# EAGLE schematic centuryBoosterPac (EAGLE 7.2.0)
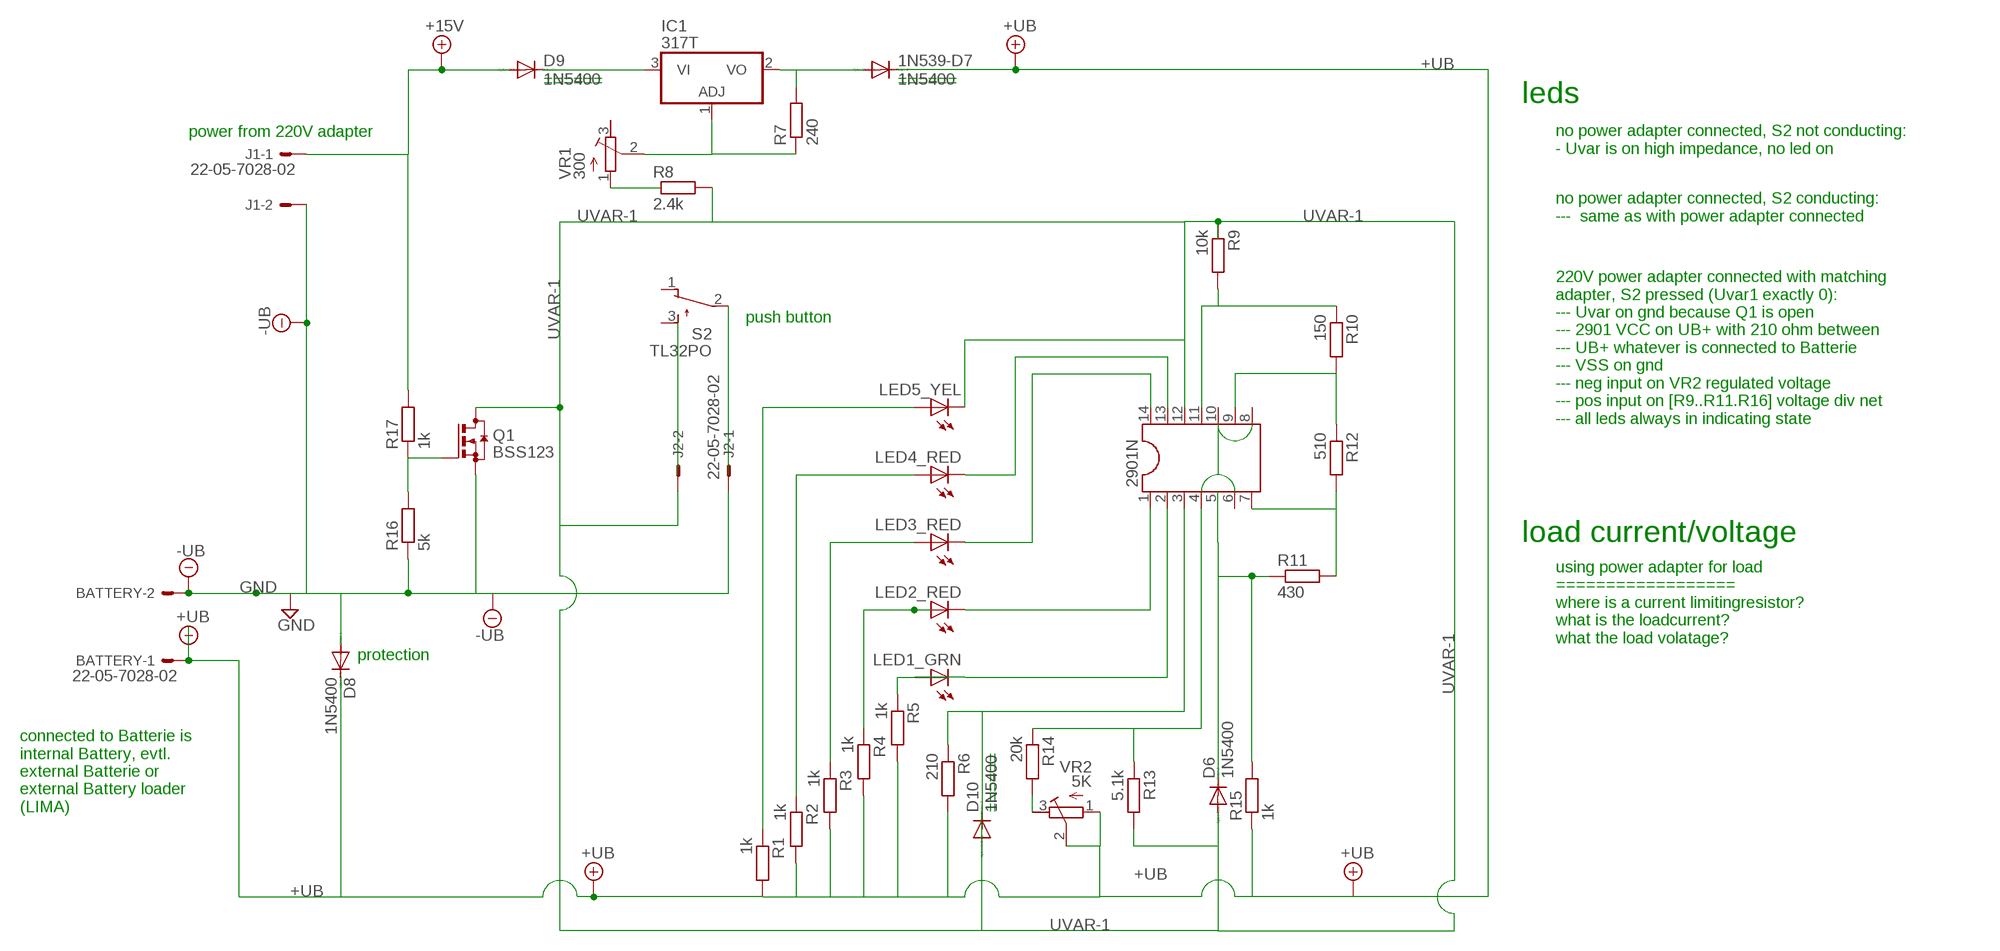
[diagram p0: schematic, sheet 1]

## Parts
1N539-D7  1N5400  [DO201-15]
2901N  DIL14  [DIL14]
BATTERY  22-05-7028-02  [7395-02]
D6  1N5400  [DO201-15]
D8  1N5400  [DO201-15]
D9  1N5400  [DO201-15]
D10  1N5400  [DO201-15]
IC1  317T  [TO220H]
J1  22-05-7028-02  [7395-02]
J2  22-05-7028-02  [7395-02]
LED1_GRN  LED  [SMARTLED-TTW]
LED2_RED  LED  [SMARTLED-TTW]
LED3_RED  LED  [SMARTLED-TTW]
LED4_RED  LED  [SMARTLED-TTW]
LED5_YEL  LED  [SMARTLED-TTW]
Q1  BSS123  [SOT23]
R1  1k  R-EU_0309/10  [0309/10]
R2  1k  R-EU_0309/10  [0309/10]
R3  1k  R-EU_0309/10  [0309/10]
R4  1k  R-EU_0309/10  [0309/10]
R5  1k  R-EU_0309/10  [0309/10]
R6  210  R-EU_0309/10  [0309/10]
R7  240  R-EU_0309/10  [0309/10]
R8  2.4k  R-EU_0309/10  [0309/10]
R9  10k  R-EU_0309/10  [0309/10]
R10  150  R-EU_0309/10  [0309/10]
R11  430  R-EU_0309/10  [0309/10]
R12  510  R-EU_0309/10  [0309/10]
R13  5.1k  R-EU_0309/10  [0309/10]
R14  20k  R-EU_0309/10  [0309/10]
R15  1k  R-EU_0309/10  [0309/10]
R16  5k  R-EU_0309/10  [0309/10]
R17  1k  R-EU_0309/10  [0309/10]
S2  TL32PO  [TL3XPO]
VR1  300  R-TRIMM3202  [RTRIM3202]
VR2  5K  R-TRIMM3202  [RTRIM3202]

## Nets
+UB: 1N539-D7.C BATTERY.1 D8.C R1.2 R5.2 R6.2 R15.1 VR2.1(A) VR2.2(S)
GND: BATTERY.2 D8.A J1.2 J2.1 Q1.2(S) R16.1 ; supply symbol labelled -UB
N$1: Q1.1(G) R16.2 R17.1
N$2: 1N539-D7.A IC1.2(VO) R7.2
N$3: VR1.1(A)
N$4: IC1.1(ADJ) R7.1 VR1.2(S)
N$6: 2901N.2 LED1_GRN.A@1(A) LED1_GRN.C@1(C) R5.1
N$8: R14.2 VR2.3(E)
N$9: 2901N.4 R13.1 R14.1
N$11: 2901N.9 R10.2 R12.1
N$12: 2901N.11 R9.2 R10.1
N$14: D6.C R11.1 R15.2
N$15: LED2_RED.A@1(A) R4.1
N$16: LED3_RED.A@1(A) R3.1
N$17: LED4_RED.A@1(A) R2.1
N$18: LED5_YEL.A@1(A) R1.1
N$20: R2.2
N$21: R3.2
N$22: R4.2
N$23: 2901N.13 LED4_RED.C@1(C)
N$24: 2901N.14 LED3_RED.C@1(C)
N$25: 2901N.1 LED2_RED.C@1(C)
N$27: 2901N.3 R6.1
N$28: S2.2(P)
N$29: D9.C IC1.3(VI)
N$30: 2901N.5
N$31: D9.A J1.1 R17.2 ; supply symbol labelled +15V
N$V12: 2901N.7 R11.2 R12.2
UVAR-1: 2901N.12 D6.A D10.A D10.C J2.2 LED5_YEL.C@1(C) Q1.3(D) R8.2 R9.1 R13.2
Unconnected: 2901N.6 2901N.8 2901N.10 R8.1 S2.1(O) S2.3(S) VR1.3(E)

## Notes on the sheet
- ====== | ======
- leds
- power from 220V adapter
- no power adapter connected, S2 not conducting:
  - Uvar is on high impedance, no led on
- no power adapter connected, S2 conducting:
  ---  same as with power adapter connected
- push button
- 220V power adapter connected with matching
  adapter, S2 pressed (Uvar1 exactly 0):
  --- Uvar on gnd because Q1 is open
  --- 2901 VCC on UB+ with 210 ohm between
  --- UB+ whatever is connected to Batterie
  --- VSS on gnd
  --- neg input on VR2 regulated voltage
  --- pos input on [R9..R11.R16] voltage div net
  --- all leds always in indicating state
- load current/voltage
- using power adapter for load
  ==================
  where is a current limitingresistor? 
  what is the loadcurrent?
  what the load volatage?
- protection
- connected to Batterie is 
  internal Battery, evtl.
  external Batterie or
  external Battery loader
  (LIMA)
- ======

## Library data of the parts
1N539-D7 D6 D8-D10 = diode:1N5400: DIODE standard rectifier, 3 A, 50 V (Motorola)
2901N = ic-package:DIL14: Dual In Line / Socket
BATTERY J1 J2 = con-molex:22-?-02: CONNECTOR wire to board 2.54 mm (.1 inch) pitch header; OC_FARNELL: 9731601; OC_NEWARK: unknown
IC1 = linear:*317: Positive VOLTAGE REGULATOR
LED1_GRN LED2_RED LED3_RED LED4_RED LED5_YEL = led:LED: LED OSRAM: - CHIPLED LG R971, LG N971, LY N971, LG Q971, LY Q971, LO R971, LY R971 LH N974, LH R974 LS Q976, LO Q976, LY Q976 LO Q996 - Hyper CHIPLED LW Q18S LB Q993, LB Q99A, LB R99A - SideLED LS A670, LO A670, LY A670, LG A670, LP A670 LB A673, LV A673, LT A673, LW A673 LH A674 LY A675 LS A676, LA A676, LO A676, LY A676, LW A676 LS A679, LY A679, LG A679 - Hyper Micro SIDELED® LS Y876, LA Y876, LO Y876, LY Y876 LT Y87S - SmartLED LW L88C, LW L88S LB L89C, LB L89S, LG L890 LS L89K, LO L89K, LY L89K LS L896, LA L896, LO L896, LY L896 - TOPLED LS T670, LO T670, LY T670, LG T670, LP T670 LSG T670, LSP T670, LSY T670, LOP T670, LYG T670 LG T671, LOG T671, LSG T671 LB T673, LV T673, LT T673, LW T673 LH T674 LS T676, LA T676, LO T676, LY T676, LB T676, LH T676, LSB T676, LW T676 LB T67C, LV T67C, LT T67C, LS T67K, LO T67K, LY T67K, LW E67C LS E67B, LA E67B, LO E67B, LY E67B, LB E67C, LV E67C, LT E67C LW T67C LS T679, LY T679, LG T679 LS T770, LO T770, LY T770, LG T770, LP T770 LB T773, LV T773, LT T773, LW T773 LH T774 LS E675, LA E675, LY E675, LS T675 LS T776, LA T776, LO T776, LY T776, LB T776 LHGB T686 LT T68C, LB T68C - Hyper Mini TOPLED® LB M676 - Mini TOPLED Santana® LG M470 LS M47K, LO M47K, LY M47K Source: http://www.osram.convergy.de LUXEON: - LUMILED® LXK2-PW12-R00, LXK2-PW12-S00, LXK2-PW14-U00, LXK2-PW14-V00 LXK2-PM12-R00, LXK2-PM12-S00, LXK2-PM14-U00 LXK2-PE12-Q00, LXK2-PE12-R00, LXK2-PE12-S00, LXK2-PE14-T00, LXK2-PE14-U00 LXK2-PB12-K00, LXK2-PB12-L00, LXK2-PB12-M00, LXK2-PB14-N00, LXK2-PB14-P00, LXK2-PB14-Q00 LXK2-PR12-L00, LXK2-PR12-M00, LXK2-PR14-Q00, LXK2-PR14-R00 LXK2-PD12-Q00, LXK2-PD12-R00, LXK2-PD12-S00 LXK2-PH12-R00, LXK2-PH12-S00 LXK2-PL12-P00, LXK2-PL12-Q00, LXK2-PL12-R00 Source: www.luxeon.com KINGBRIGHT: KA-3528ASYC Source: www.kingbright.com
Q1 = transistor-small-signal:BSS123: N-CHANNEL MOS FET
R1-R17 = resistor:R-EU_: RESISTOR, European symbol
S2 = switch:TL32PO: TINY SWITCH ON - MOM Source: http://www2.produktinfo.conrad.com/datenblaetter/700000-724999/705152-da-01-de-Subminiaturschalter_TL_36YO.pdf
VR1 VR2 = rcl:R-TRIMM: Trimm resistor